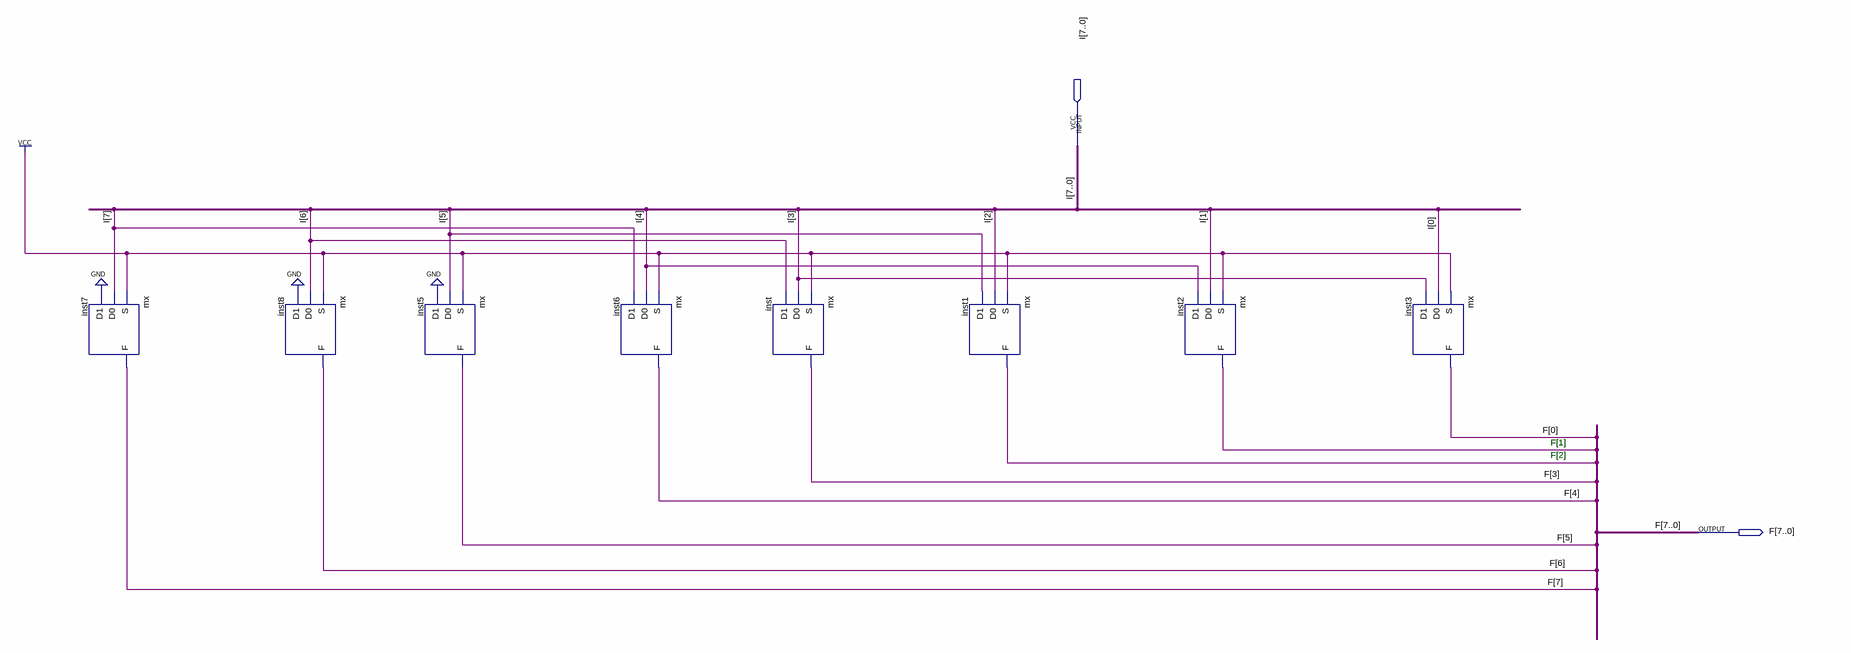
[diagram p0: schematic sheet]
// Quartus schematic ShiftR3.bdf as structural Verilog: 8 symbols, 2 pins
module ShiftR3 (
  input  [7:0] I,
  output [7:0] F
);

  mx inst7 (.S(1'b1), .D0(I[7]), .D1(1'b0), .F(F[7]));
  mx inst8 (.S(1'b1), .D0(I[6]), .D1(1'b0), .F(F[6]));
  mx inst5 (.S(1'b1), .D0(I[5]), .D1(1'b0), .F(F[5]));
  mx inst6 (.S(1'b1), .D0(I[4]), .D1(I[7]), .F(F[4]));
  mx inst (.S(1'b1), .D0(I[3]), .D1(I[6]), .F(F[3]));
  mx inst1 (.S(1'b1), .D0(I[2]), .D1(I[5]), .F(F[2]));
  mx inst2 (.S(1'b1), .D0(I[1]), .D1(I[4]), .F(F[1]));
  mx inst3 (.S(1'b1), .D0(I[0]), .D1(I[3]), .F(F[0]));

  // Notes on the sheet:
  //   F[1]
  //   F[1]
  //   F[2]
endmodule
